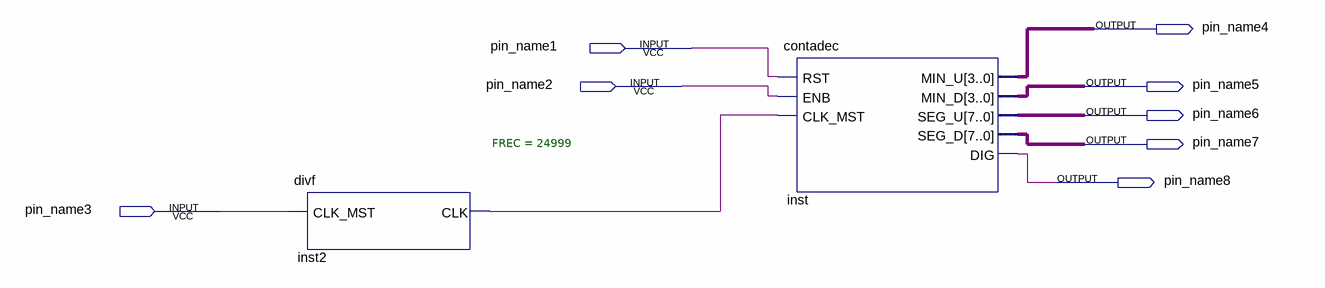
[diagram p0: schematic sheet]
// Quartus schematic Tarea_1.bdf as structural Verilog: 2 symbols, 8 pins
module Tarea_1 (
  input  pin_name1,
  input  pin_name2,
  input  pin_name3,
  output pin_name4,
  output pin_name5,
  output pin_name6,
  output pin_name7,
  output pin_name8
);

  wire inst2_clk;
  wire [3:0] inst_min_d, inst_min_u;
  wire [7:0] inst_seg_d, inst_seg_u;

  divf #(.FREC(24999)) inst2 (.CLK_MST(pin_name3), .CLK(inst2_clk));
  contadec inst (
    .RST(pin_name1), .ENB(pin_name2), .CLK_MST(inst2_clk), .MIN_U(inst_min_u), .MIN_D(inst_min_d),
    .SEG_U(inst_seg_u), .SEG_D(inst_seg_d), .DIG(pin_name8));
endmodule
